# EAGLE design pcb1e (EAGLE 9.6.2)
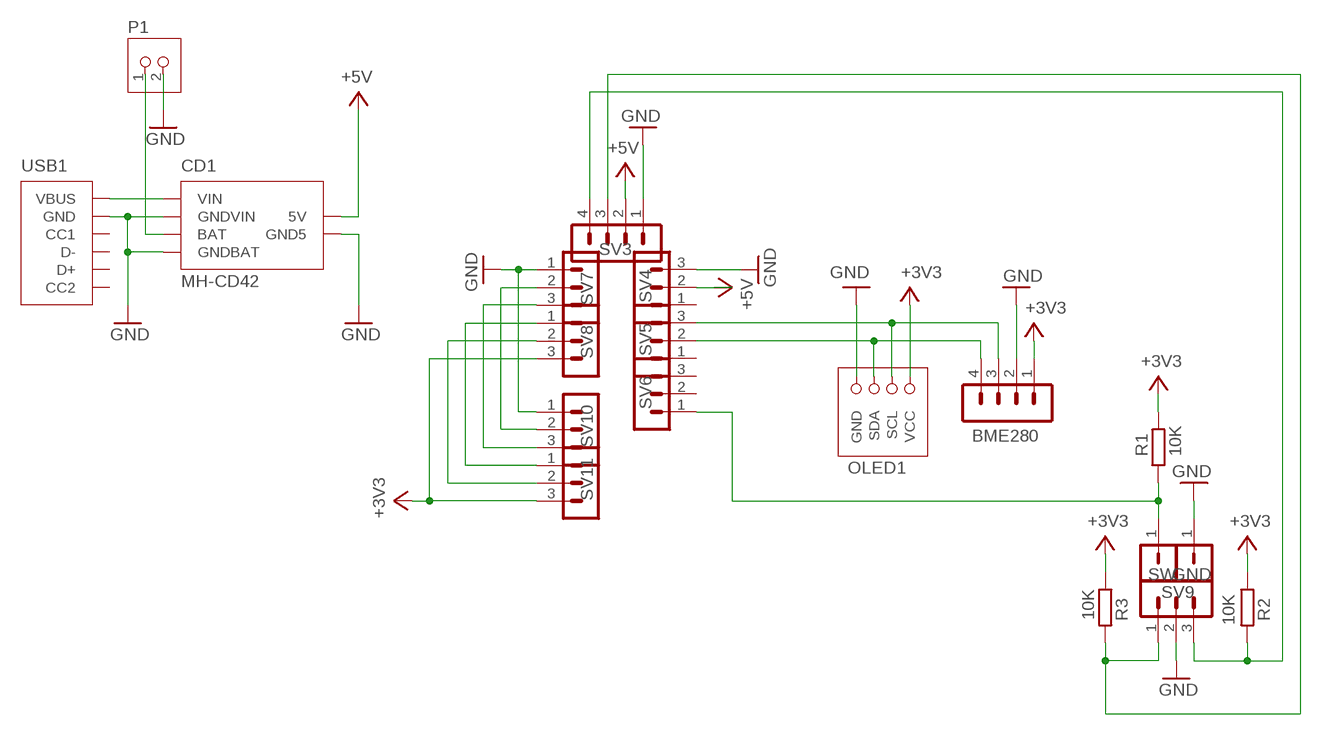
[diagram p0: schematic, sheet 1]

## Parts
BME280  PINHEAD-MA04-1  [PINHEAD-MA04-1]
CD1  MH-CD42  [MH-CD42]
GND  PINHEAD-MA01-1  [PINHEAD-MA01-1]
OLED1  OLED-SSD1306-0.96  [OLED-I2C-0.96]
P1  JST-PH2  [JST-PH2]
R1  10K  R-EU_0204/5  [0204/5]
R2  10K  R-EU_0204/5  [0204/5]
R3  10K  R-EU_0204/5  [0204/5]
SV3  PINHEAD-MA04-1  [PINHEAD-MA04-1]
SV4  PINHEAD-MA03-1  [PINHEAD-MA03-1]
SV5  PINHEAD-MA03-1  [PINHEAD-MA03-1]
SV6  PINHEAD-MA03-1  [PINHEAD-MA03-1]
SV7  PINHEAD-MA03-1  [PINHEAD-MA03-1]
SV8  PINHEAD-MA03-1  [PINHEAD-MA03-1]
SV9  PINHEAD-MA03-1  [PINHEAD-MA03-1]
SV10  PINHEAD-MA03-1  [PINHEAD-MA03-1]
SV11  PINHEAD-MA03-1  [PINHEAD-MA03-1]
SW  PINHEAD-MA01-1  [PINHEAD-MA01-1]
USB1  USB-C-DIRECT  [USB-C-DIRECT]

## Nets
+3V3: BME280.1 OLED1.VCC R1.2 R2.1 R3.1 SV8.3 SV11.3
+5V: CD1.5V SV3.2 SV4.2
BAT+: CD1.BAT P1.1
GND: BME280.2 CD1.GND5V(GND5) CD1.GNDBAT CD1.GNDVIN GND.1 OLED1.GND P1.2 SV3.1 SV4.3 SV7.1 SV9.2 SV10.1 USB1.GND
N$1: CD1.VIN USB1.VBUS
N$2: BME280.3 OLED1.SCL SV5.3
N$3: BME280.4 OLED1.SDA SV5.2
N$4: SV7.2 SV10.2
N$5: R1.1 SV6.1 SW.1
N$6: R3.2 SV3.3 SV9.1
N$7: SV7.3 SV10.3
N$8: SV8.1 SV11.1
N$9: SV8.2 SV11.2
N$11: R2.2 SV3.4 SV9.3
Unconnected: SV4.1 SV5.1 SV6.2 SV6.3 USB1.CC1 USB1.CC2 USB1.D+ USB1.D-

## Library data of the parts
BME280 SV3 = ytani1:PINHEAD-MA04-1: PIN HEADER; OC_FARNELL: unknown; OC_NEWARK: unknown
CD1 = ytani1:MH-CD42
GND SW = ytani1:PINHEAD-MA01-1
OLED1 = ytani1:OLED-SSD1306-0.96: OLED SSD1306 0.96inch 128x96 I2C https://akizukidenshi.com/catalog/g/gP-12031/ Vcc: 3V-5.5V I2C addr: 0x3C Control chip: SSD1306 Blank/White; OC_AKIZUKI: P-12031; URL_AKIZUKI: https://akizukidenshi.com/catalog/g/gP-12031/
P1 = ytani1:JST-PH2
R1-R3 = rcl:R-EU_: RESISTOR, European symbol; SPICEPREFIX: R
SV4-SV11 = ytani1:PINHEAD-MA03-1: PIN HEADER; OC_FARNELL: unknown; OC_NEWARK: unknown
USB1 = ytani1:USB-C-DIRECT

## Board
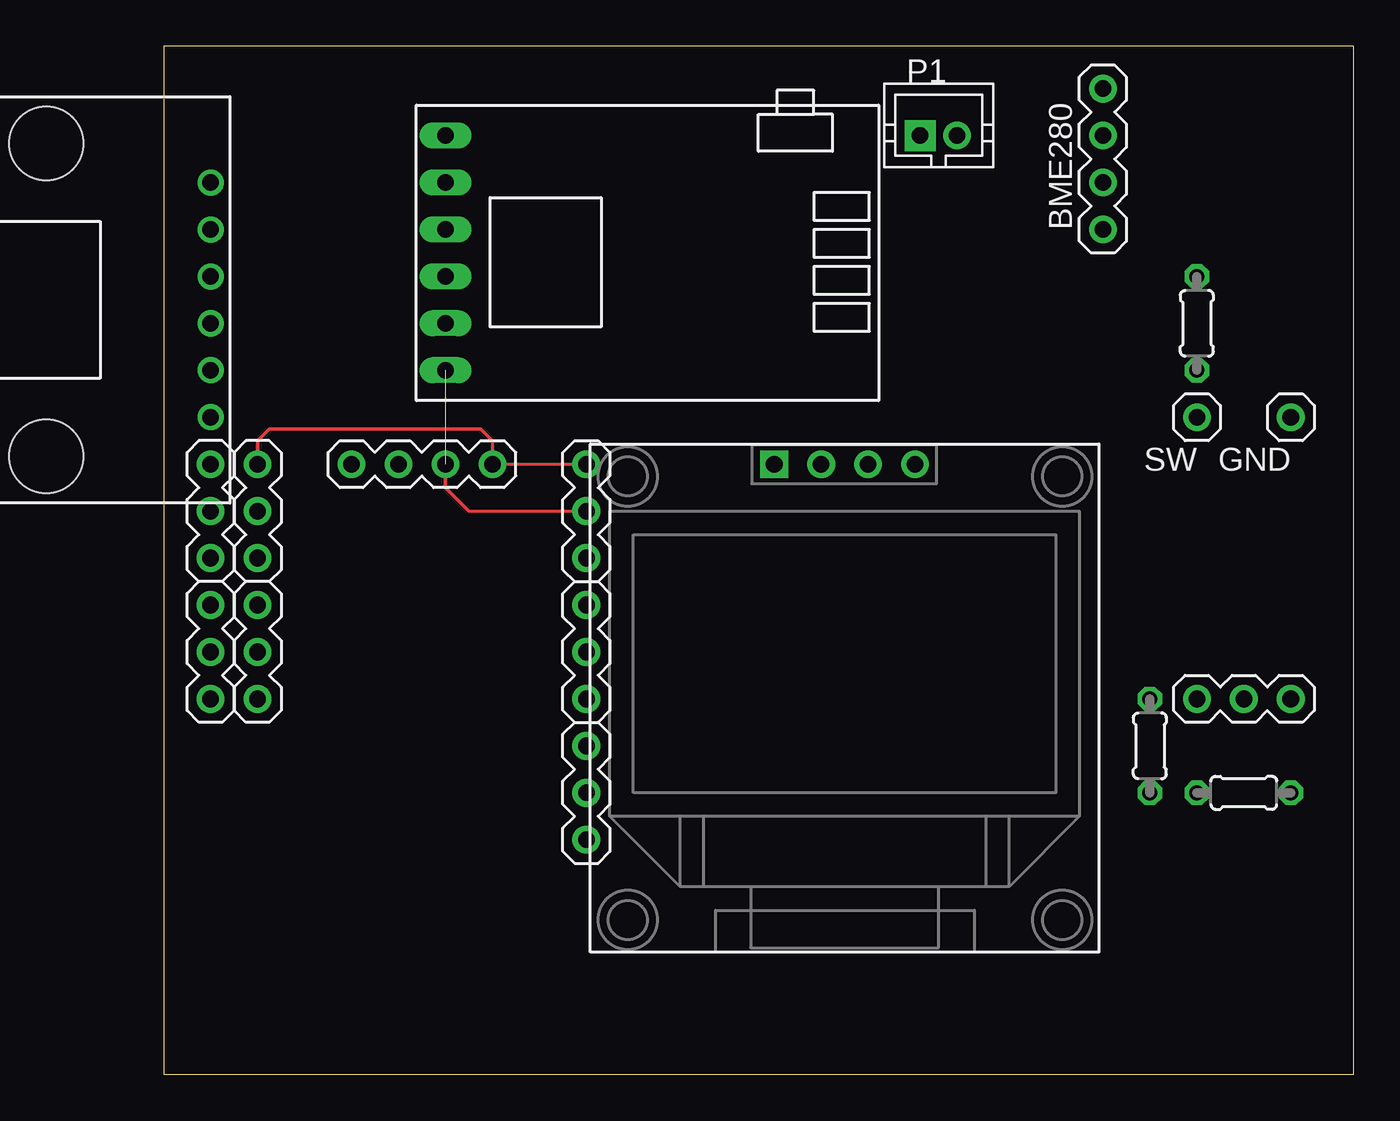
[diagram p1: board, top side]
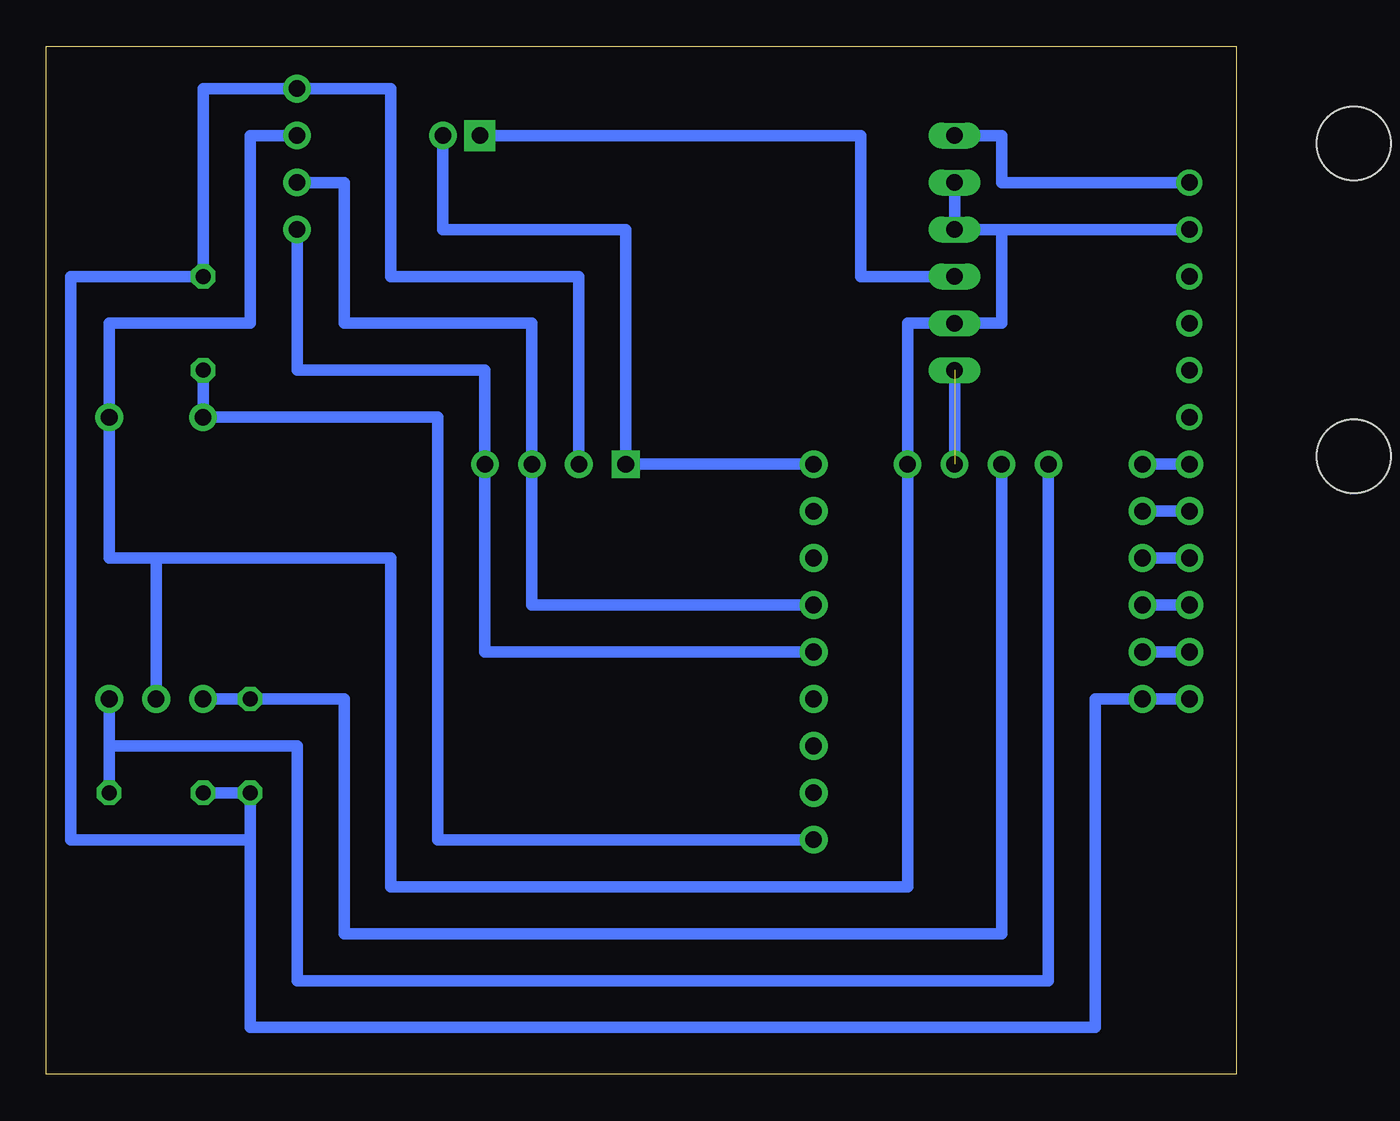
[diagram p2: board, bottom side, seen from below]

Size 64.36 x 55.63 mm. Coordinates in mm from the lower left corner, seen from the top.
Outline: 0,0 64.36,0 64.36,55.63 0,55.63 0,0
Copper layers (1*16): Top 0.035mm / dielectric 1.5mm / Bottom 0.035mm
Design rules "default": minimum track width 6mil, minimum drill 0.35mm, track to track 6mil, track to pad 6mil, pad to pad 6mil, via to via 6mil, smd to smd 6mil, copper to edge 40mil, drill to drill 6mil, minimum pad ring 10mil, minimum via ring 8mil, stop-mask expansion 4mil, vias tented up to drill 0mil, thermal gap 10mil

### Footprints (pad centres in the part's own frame; a part is rotated, then mirrored left to right if it is on the bottom)
PINHEAD-MA04-1 = drill 0.9 pad 1.5: 1 -3.81,0; 2 -1.27,0; 3 1.27,0; 4 3.81,0
MH-CD42 = drill 0.9 long: 5V 10.16,6.35; BAT 10.16,1.27; GND5V 10.16,3.81; GNDBAT 10.16,-1.27; GNDVIN 10.16,-3.81; VIN 10.16,-6.35
PINHEAD-MA01-1 = drill 0.9 pad 1.5: 1 1.27,0
OLED-I2C-0.96 = drill 0.9 pad 1.5 square: GND -5.08,10.16 | drill 0.9 pad 1.5: SCL 0,10.16; SDA 2.54,10.16; VCC -2.54,10.16
JST-PH2 = drill 0.9 pad 1.676 square: 1 -1,0 | drill 0.9 pad 1.5: 2 1,0
0204/5 = drill 0.813 octagon: 1 -2.54,0; 2 2.54,0
PINHEAD-MA03-1 = drill 0.9 pad 1.5: 1 -1.27,0; 2 1.27,0; 3 3.81,0
USB-C-DIRECT = drill 0.9: CC1 1.27,-13.97; CC2 -6.35,-13.97; D+ -3.81,-13.97; D- -1.27,-13.97; GND 3.81,-13.97; VBUS 6.35,-13.97 | hole 4: -8.46,-5.08; 8.46,-5.08

### Placement (x,y rotation side)
BME280  50.8,49.53 270 top
CD1  25.4,44.45 180 top
GND  59.69,35.56 0 top
OLED1  38.1,22.86 0 top
P1  41.91,50.8 0 top
R1  55.88,40.64 90 top
R2  58.42,15.24 0 top
R3  53.34,17.78 90 top
SV3  13.97,33.02 180 top
SV4  22.86,29.21 90 top
SV5  22.86,21.59 90 top
SV6  22.86,13.97 90 top
SV7  5.08,31.75 270 top
SV8  5.08,24.13 270 top
SV9  57.15,20.32 0 top
SV10  2.54,31.75 270 top
SV11  2.54,24.13 270 top
SW  54.61,35.56 0 top
USB1  -11.43,41.91 90 top

### Tracks (layer width: path | path; a pad name or v marks a point on that pad's centre or on a via)
+3V3
  Bottom 0.61: OLED1.VCC 35.56,43.18 45.72,43.18 45.72,53.34 BME280.1 55.88,53.34 R1.2 63.04,43.18 63.04,12.7 53.34,12.7 | R2.1 R3.1 53.34,12.7 | 53.34,12.7 53.34,2.54 7.62,2.54 7.62,20.32 SV8.3 SV11.3
+5V  (2 unrouted)
  Top 0.152: 16.51,30.48 SV4.2
  Top 0.2: SV3.2 15.24,31.75 16.51,30.48
  Bottom 0.61: CD1.5V SV3.2
BAT+
  Bottom 0.61: CD1.BAT 20.32,43.18 20.32,50.8 P1.1
GND
  Top 0.152: 17.78,34.29 SV3.1 SV4.3
  Top 0.2: SV7.1 5.08,34.29 5.71,34.92 17.14,34.92 17.78,34.29
  Bottom 0.61: SV7.1 SV10.1 | SV9.2 58.42,27.94 | 58.42,27.94 60.96,27.94 GND.1 60.96,40.64 53.34,40.64 53.34,50.8 BME280.2 | 58.42,27.94 45.72,27.94 45.72,10.16 17.78,10.16 SV3.1 17.78,40.64 CD1.GND5V 12.7,40.64 12.7,45.72 | CD1.GNDVIN CD1.GNDBAT 12.7,45.72 | 12.7,45.72 USB1.GND | 23.86,33.02 SV4.3 OLED1.GND 33.02,45.72 42.91,45.72 P1.2
N$1
  Bottom 0.61: USB1.VBUS 12.7,48.26 12.7,50.8 CD1.VIN
N$2
  Bottom 0.61: SV5.3 38.1,25.4 OLED1.SCL 38.1,40.64 48.26,40.64 48.26,48.26 BME280.3
N$3
  Bottom 0.61: SV5.2 40.64,22.86 OLED1.SDA 40.64,38.1 50.8,38.1 BME280.4
N$4
  Bottom 0.61: SV7.2 SV10.2
N$5
  Bottom 0.61: R1.1 SW.1 43.18,35.56 43.18,12.7 SV6.1
N$6
  Bottom 0.61: SV9.1 R3.2 48.26,20.32 48.26,7.62 12.7,7.62 SV3.3
N$7
  Bottom 0.61: SV7.3 SV10.3
N$8
  Bottom 0.61: SV8.1 SV11.1
N$9
  Bottom 0.61: SV8.2 SV11.2
N$11
  Bottom 0.61: SV3.4 10.16,5.08 50.8,5.08 50.8,17.78 60.96,17.78 | SV9.3 60.96,17.78 | 60.96,17.78 R2.2